# EAGLE design test (EAGLE 8.1.0)
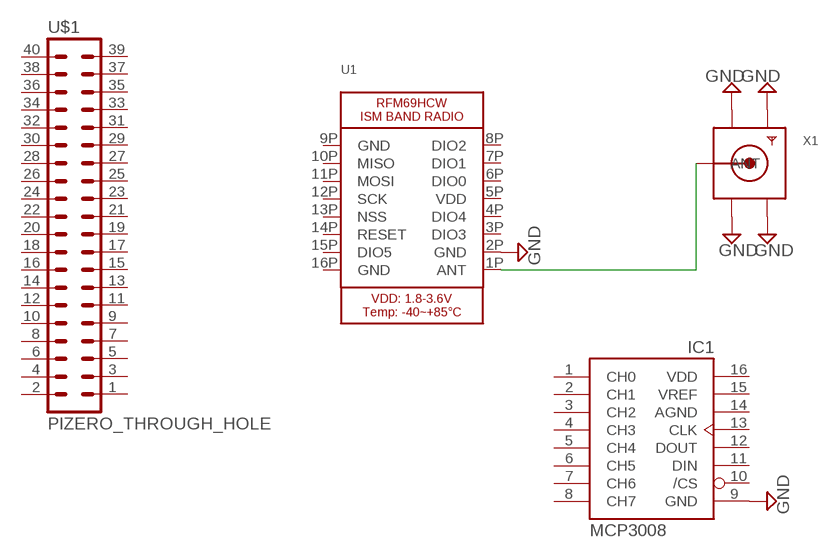
[diagram p0: schematic, sheet 1]

## Parts
IC1  MCP3008  [DIL16]
U1  MICROBUILDER_RFM69HCW_SMT  [MICROBUILDER_RFMHCW_SMT]
U$1  PIZERO_THROUGH_HOLE  [PIZERO_THOUGH_HOLE]
X1  MICROBUILDER_SMACONNECTOR_EDGE  [MICROBUILDER_SMA_EDGELAUNCH]

## Nets
GND: IC1.9(GND) U1.2P(GND) X1.GND@1(GND4) X1.GND@2(GND3) X1.GND@3(GND2) X1.GND@4(GND1)
N$1: U1.1P(ANT) X1.P(ANT)
Unconnected: IC1.1(CH0) IC1.2(CH1) IC1.3(CH2) IC1.4(CH3) IC1.5(CH4) IC1.6(CH5) IC1.7(CH6) IC1.8(CH7) IC1.10(/CS) IC1.11(DIN) IC1.12(DOUT) IC1.13(CLK) IC1.15(VREF) U1.3P(DIO3) U1.4P(DIO4) U1.6P(DIO0) U1.7P(DIO1) U1.8P(DIO2) U1.10P(MISO) U1.11P(MOSI) U1.12P(SCK) U1.13P(NSS) U1.14P(RESET) U1.15P(DIO5) U$1.1 U$1.2 U$1.3 U$1.4 U$1.5 U$1.6 U$1.7 U$1.8 U$1.9 U$1.10 U$1.11 U$1.12 U$1.13 U$1.14 U$1.15 U$1.16 U$1.17 U$1.18 U$1.19 U$1.20 U$1.21 U$1.22 U$1.23 U$1.24 U$1.25 U$1.26 U$1.27 U$1.28 U$1.29 U$1.30 U$1.31 U$1.32 U$1.33 U$1.34 U$1.35 U$1.36 U$1.37 U$1.38 U$1.39 U$1.40

## Power pins joined to a net without a drawn wire
AGND: IC1.14(AGND)
GND: U1.9P(GND) U1.16P(GND)
VDD: IC1.16(VDD) U1.5P(VDD)

## Library data of the parts
IC1 = adafruit:MCP3008
U1 = Adafruit RFM+LoRa Breakout:MICROBUILDER_RFM69HCW: RFM69HCW - ISM Band RF Transceiver
U$1 = pizero:PIZERO_THROUGH_HOLE
X1 = Adafruit RFM+LoRa Breakout:MICROBUILDER_SMACONNECTOR: SMA Connector 90° DIP SMA Connector, 50 Ohm (4UConnector: 07259)

## Board
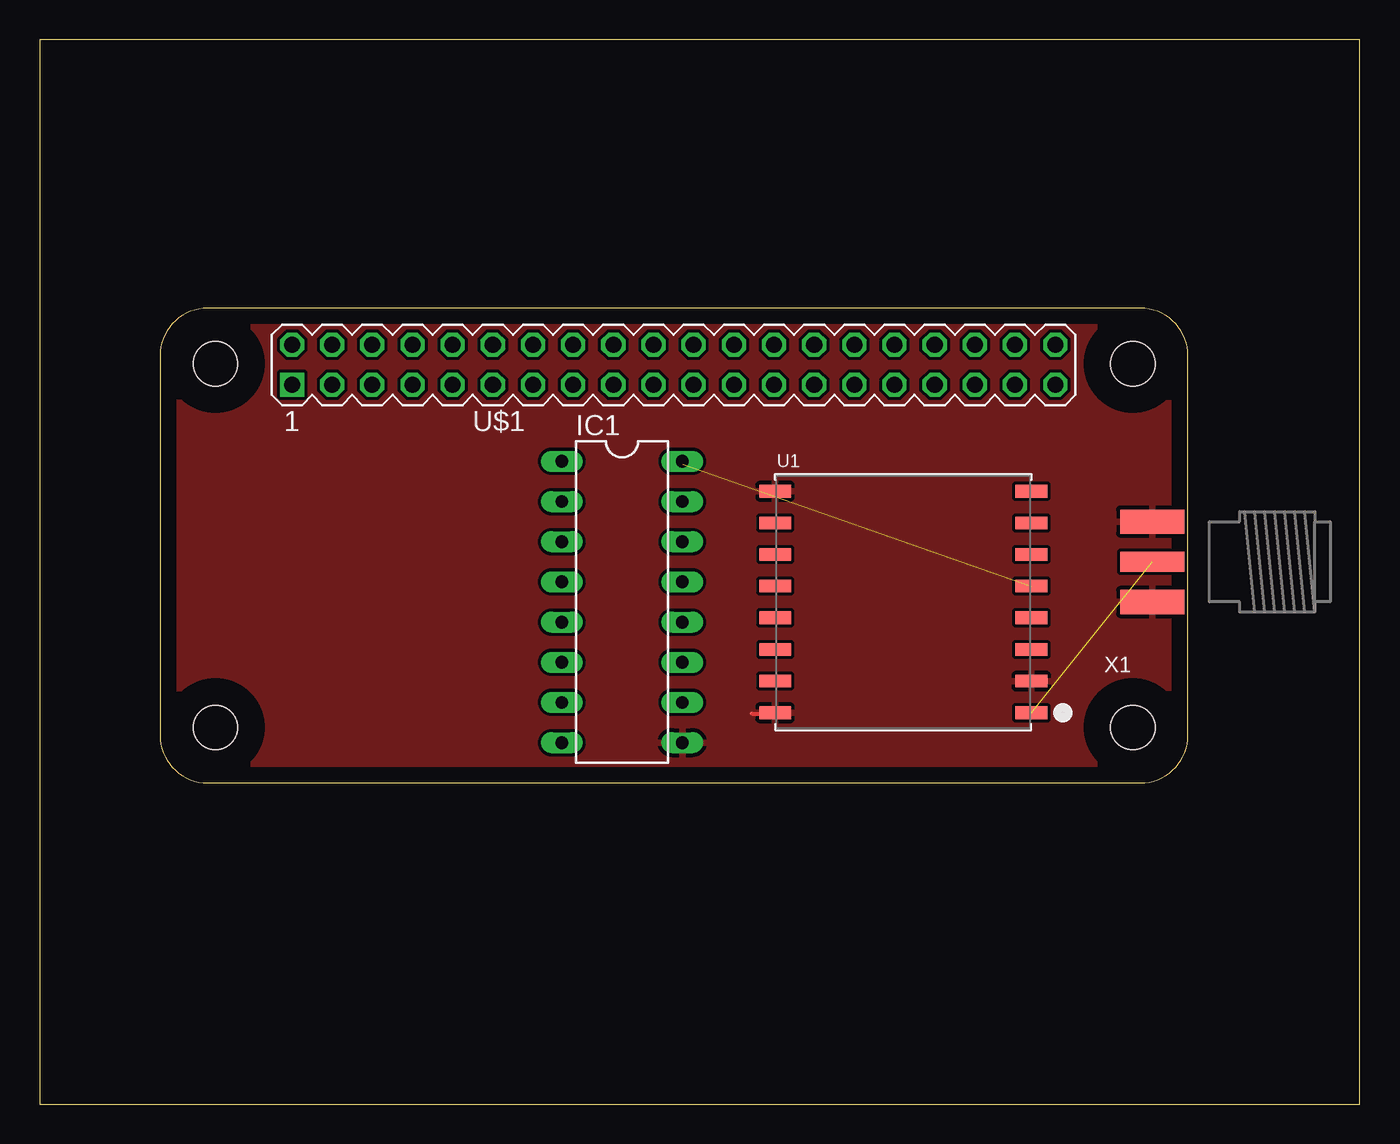
[diagram p1: board, top side]
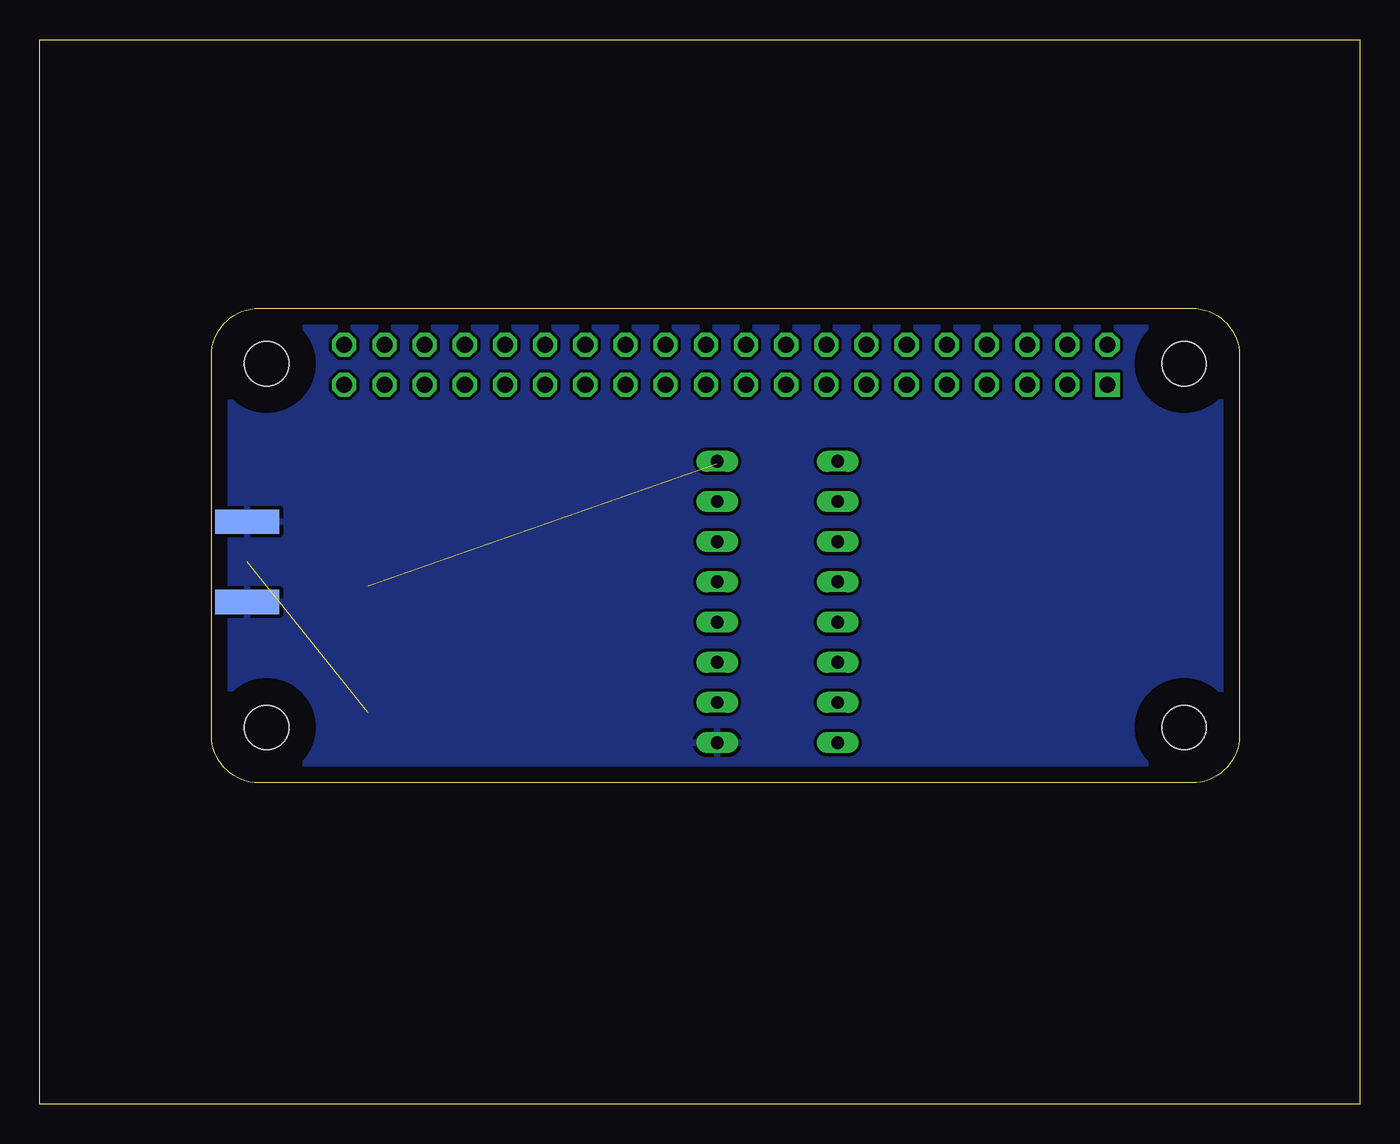
[diagram p2: board, bottom side, seen from below]

Size 83.49 x 67.3 mm. Coordinates in mm from the lower left corner, seen from the top.
Outline: 0,0 83.49,0 83.49,67.3 0,67.3 0,0
Copper layers (1*16): Top 0.035mm / dielectric 1.5mm / Bottom 0.035mm
Design rules "default": minimum track width 10mil, minimum drill 24mil, track to track 8mil, track to pad 8mil, pad to pad 8mil, via to via 8mil, smd to smd 8mil, copper to edge 40mil, drill to drill 8mil, minimum pad ring 10mil, minimum via ring 8mil, stop-mask expansion 4mil, vias tented up to drill 0mil, thermal gap 10mil

### Footprints (pad centres in the part's own frame; a part is rotated, then mirrored left to right if it is on the bottom)
DIL16 = drill 0.813 long: 1 -8.89,-3.81; 2 -6.35,-3.81; 3 -3.81,-3.81; 4 -1.27,-3.81; 5 1.27,-3.81; 6 3.81,-3.81; 7 6.35,-3.81; 8 8.89,-3.81; 9 8.89,3.81; 10 6.35,3.81; 11 3.81,3.81; 12 1.27,3.81; 13 -1.27,3.81; 14 -3.81,3.81; 15 -6.35,3.81; 16 -8.89,3.81
MICROBUILDER_RFMHCW_SMT = smd 2 x 0.8: 1P 8.1,-7; 2P 8.1,-5; 3P 8.1,-3; 4P 8.1,-1; 5P 8.1,1; 6P 8.1,3; 7P 8.1,5; 8P 8.1,7; 9P -8.1,7; 10P -8.1,5; 11P -8.1,3; 12P -8.1,1; 13P -8.1,-1; 14P -8.1,-3; 15P -8.1,-5; 16P -8.1,-7
PIZERO_THOUGH_HOLE = drill 1.016 square: 1 8.34,25.15 | drill 1.016 octagon: 2 8.34,27.69; 3 10.88,25.15; 4 10.88,27.69; 5 13.42,25.15; 6 13.42,27.69; 7 15.96,25.15; 8 15.96,27.69; 9 18.5,25.15; 10 18.5,27.69; 11 21.04,25.15; 12 21.04,27.69; 13 23.58,25.15; 14 23.58,27.69; 15 26.12,25.15; 16 26.12,27.69; 17 28.66,25.15; 18 28.66,27.69; 19 31.2,25.15; 20 31.2,27.69; 21 33.74,25.15; 22 33.74,27.69; 23 36.28,25.15; 24 36.28,27.69; 25 38.82,25.15; 26 38.82,27.69; 27 41.36,25.15; 28 41.36,27.69; 29 43.9,25.15; 30 43.9,27.69; 31 46.44,25.15; 32 46.44,27.69; 33 48.98,25.15; 34 48.98,27.69; 35 51.52,25.15; 36 51.52,27.69; 37 54.06,25.15; 38 54.06,27.69; 39 56.6,25.15; 40 56.6,27.69 | hole 2.8: 3.5,3.5; 3.5,26.5; 61.5,26.5; 61.5,3.5
MICROBUILDER_SMA_EDGELAUNCH = smd 4.064 x 1.524: GND@1 2.032,-2.54; GND@2 2.032,2.54 | smd 4.064 x 1.524 bottom: GND@3 2.032,2.54; GND@4 2.032,-2.54 | smd 4.064 x 1.27: P 2.032,0

### Placement (x,y rotation side)
IC1  36.83,31.75 270 top
U1  54.61,31.75 0 top
U$1  7.62,20.32 0 top
X1  72.39,34.29 180 top

### Tracks (layer width: path | path; a pad name or v marks a point on that pad's centre or on a via)
GND
  Top 0.254: 45.03,24.69 46.41,24.69 U1.16P | 40.69,22.86 IC1.9 | 46.41,38.63 U1.9P
  pour Bottom: 0,69.85 86.36,69.85 86.36,64.77 86.36,-2.54 0,-2.54
  pour Top: -1.27,67.31 83.82,67.31 83.82,-2.54 -1.27,-2.54
N$1  (1 unrouted)
VDD  (1 unrouted)
  Top 0.254: 40.69,40.46 IC1.16